# EAGLE schematic ESP32 UWB v1.0 (EAGLE 6.6.0)
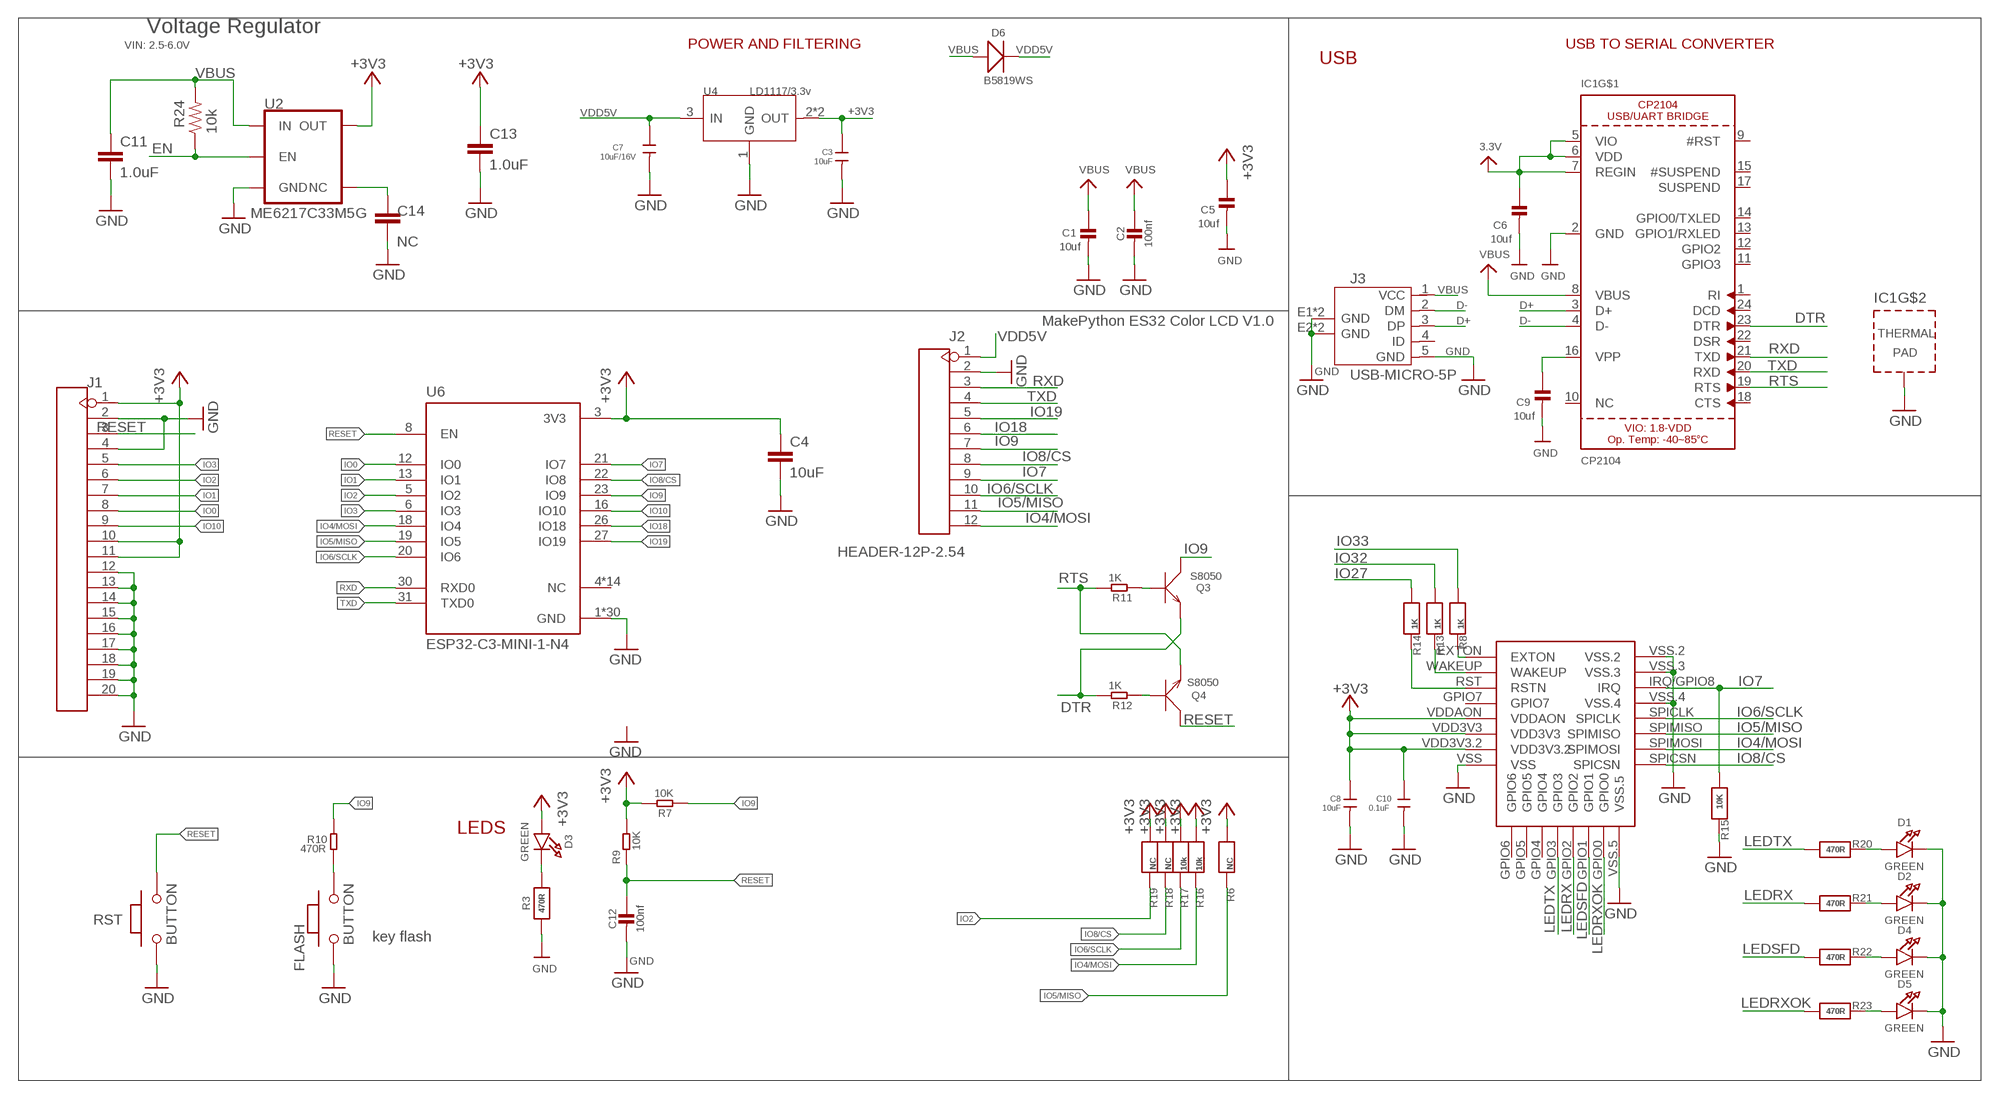
[diagram p0: schematic, sheet 1]

## Parts
C1  10uf  CAP_CERAMIC0603_NO  [0603-NO]
C2  100nf  CAP_CERAMIC0603_NO  [0603-NO]
C3  10uF  C-0603  [C0603]
C4  10uF  C-EUC0603  [C0603]
C5  10uf  CAP_CERAMIC0603_NO  [0603-NO]
C6  10uf  CAP_CERAMIC0603_NO  [0603-NO]
C7  10uF/16V  C-0603  [C0603]
C8  10uF  C-0603  [C0603]
C9  10uf  CAP_CERAMIC0603_NO  [0603-NO]
C10  0.1uF  C-0603  [C0603]
C11  1.0uF  1.0UF-0603-16V-10%  [0603]
C12  100nf  CAP_CERAMIC0603_NO  [0603-NO]
C13  1.0uF  1.0UF-0603-16V-10%  [0603]
C14  NC  1.0UF-0603-16V-10%  [0603]
D1  GREEN  LED0805_NOOUTLINE  [CHIPLED_0805_NOOUTLINE]
D2  GREEN  LED0805_NOOUTLINE  [CHIPLED_0805_NOOUTLINE]
D3  GREEN  LED0805_NOOUTLINE  [CHIPLED_0805_NOOUTLINE]
D4  GREEN  LED0805_NOOUTLINE  [CHIPLED_0805_NOOUTLINE]
D5  GREEN  LED0805_NOOUTLINE  [CHIPLED_0805_NOOUTLINE]
D6  B5819WS  D'0805'  [SOD323]
FLASH  BUTTON  PB157  [157SW]
IC1  CP2104  [QFN24_4MM_SMSC]
J1  HEADER-20P-2.54  [20P-2.54]
J2  HEADER-12P-2.54  [12P-2.54]
J3  USB-MICRO-5P  [MICRO-USB-5P]
Q3  S8050  TRANSISTOR-NPN-SOT23  [SOT23]
Q4  S8050  TRANSISTOR-NPN-SOT23  [SOT23]
R3  470R  RESISTOR_0603_NOOUT  [0603-NO]
R6  NC  RESISTOR_0603_NOOUT  [0603-NO]
R7  10K  R-0603  [0603]
R8  1K  RESISTOR_0603_NOOUT  [0603-NO]
R9  10K  R-0603  [0603]
R10  470R  R-0603  [0603]
R11  1K  R-0603  [0603]
R12  1K  R-0603  [0603]
R13  1K  RESISTOR_0603_NOOUT  [0603-NO]
R14  1K  RESISTOR_0603_NOOUT  [0603-NO]
R15  10K  RESISTOR_0603_NOOUT  [0603-NO]
R16  10k  RESISTOR_0603_NOOUT  [0603-NO]
R17  10k  RESISTOR_0603_NOOUT  [0603-NO]
R18  NC  RESISTOR_0603_NOOUT  [0603-NO]
R19  NC  RESISTOR_0603_NOOUT  [0603-NO]
R20  470R  RESISTOR_0603_NOOUT  [0603-NO]
R21  470R  RESISTOR_0603_NOOUT  [0603-NO]
R22  470R  RESISTOR_0603_NOOUT  [0603-NO]
R23  470R  RESISTOR_0603_NOOUT  [0603-NO]
R24  10k  10KOHM-0603-1/10W-1%  [0603]
RST  BUTTON  PB157  [157SW]
U2  ME6217C33M5G  V_REG_AP2112K-3.3V  [SOT23-5]
U4  LD1117/3.3v  LD1117'SOT89'  [SOT89]
U5  DWM1000  [DWM1000]
U6  ESP32-C3-MINI-1-N4  [XCVR_ESP32-C3-MINI-1-N4]

## Nets
+3V3: C3.1 C4.1 C5.1 C6.1 C8.1 C10.1 C13.1 D3.A IC1.5(VIO) IC1.6(VDD) IC1.7(REGIN) J1.1 J1.10 J1.11 R6.1 R7.2 R9.2 R16.1 R17.1 R18.1 R19.1 U2.5(OUT) U4.2(OUT) U4.4(OUT) U5.VDD3V3 U5.VDD3V3.2 U5.VDDAON U6.3(3V3) ; supply symbol labelled 3.3V
D+: IC1.3(D+) J3.3(DP)
D-: IC1.4(D-) J3.2(DM)
DTR: IC1.23(DTR) Q3.2(E) R12.2
EN: R24.1 U2.3(EN)
GND: C1.2 C2.2 C3.2 C4.2 C5.2 C6.2 C7.2 C8.2 C9.2 C10.2 C11.2 C12.2 C13.2 C14.2 D1.C D2.C D4.C D5.C FLASH.1 IC1.2(GND) IC1.THERM(TP) J1.2 J1.4 J1.12 J1.13 J1.14 J1.15 J1.16 J1.17 J1.18 J1.19 J1.20 J2.2 J3.5(GND) J3.E1(GND) J3.E2(GND) J3.P1(GND) J3.P2(GND) R3.1 R15.2 RST.1 U2.2(GND) U4.1(GND) U5.VSS U5.VSS.2 U5.VSS.3 U5.VSS.4 U5.VSS.5 U6.1(GND) U6.2(GND) U6.11(GND) U6.14(GND) U6.36(GND) U6.37(GND) U6.38(GND) U6.39(GND) U6.40(GND) U6.41(GND) U6.42(GND) U6.43(GND) U6.44(GND) U6.45(GND) U6.46(GND) U6.47(GND) U6.48(GND) U6.49_1(GND) U6.49_2(GND) U6.49_3(GND) U6.49_4(GND) U6.49_5(GND) U6.49_6(GND) U6.49_7(GND) U6.49_8(GND) U6.49_9(GND) U6.50(GND) U6.51(GND) U6.52(GND) U6.53(GND)
IO0: J1.8 U6.12(IO0)
IO1: J1.7 U6.13(IO1)
IO2: J1.6 R19.2 U6.5(IO2)
IO3: J1.5 U6.6(IO3)
IO4/MOSI: J2.12 R16.2 U5.SPIMOSI U6.18(IO4)
IO5/MISO: J2.11 R6.2 U5.SPIMISO U6.19(IO5)
IO6/SCLK: J2.10 R17.2 U5.SPICLK U6.20(IO6)
IO7: J2.9 R15.1 U5.IRQ/GPIO8(IRQ) U6.21(IO7)
IO8/CS: J2.8 R18.2 U5.SPICSN U6.22(IO8)
IO9: J2.7 Q3.3(C) R7.1 R10.2 U6.23(IO9)
IO10: J1.9 U6.16(IO10)
IO18: J2.6 U6.26(IO18)
IO19: J2.5 U6.27(IO19)
IO27: R14.1
IO32: R13.1
IO33: R8.1
LEDRX: R21.1 U5.GPIO2
LEDRXOK: R23.1 U5.GPIO0
LEDSFD: R22.1 U5.GPIO1
LEDTX: R20.1 U5.GPIO3
N$1: D1.A R20.2
N$2: C9.1 IC1.16(VPP)
N$3: C14.1 U2.4(NC)
N$5: D3.C R3.2
N$10: R8.2 U5.EXTON
N$11: R13.2 U5.WAKEUP
N$12: R14.2 U5.RST(RSTN)
N$13: Q4.1(B) R12.1
N$14: Q3.1(B) R11.1
N$15: FLASH.2 R10.1
N$16: D2.A R21.2
N$17: D4.A R22.2
N$18: D5.A R23.2
RESET: C12.1 J1.3 Q4.3(C) R9.1 RST.2 U6.8(EN)
RTS: IC1.19(RTS) Q4.2(E) R11.2
RXD: IC1.21(TXD) J2.3 U6.30(RXD0)
TXD: IC1.20(RXD) J2.4 U6.31(TXD0)
VBUS: C1.1 C2.1 C11.1 D6.+ IC1.8(VBUS) J3.1(VCC) R24.2 U2.1(IN)
VDD5V: C7.1 D6.- J2.1 U4.3(IN)
Unconnected: IC1.1(RI) IC1.9(#RST) IC1.10(NC) IC1.11(GPIO3) IC1.12(GPIO2) IC1.13(GPIO1/RXLED) IC1.14(GPIO0/TXLED) IC1.15(#SUSPEND) IC1.17(SUSPEND) IC1.18(CTS) IC1.22(DSR) IC1.24(DCD) J3.4(ID) U5.GPIO4 U5.GPIO5 U5.GPIO6 U5.GPIO7 U6.4(NC) U6.7(NC) U6.9(NC) U6.10(NC) U6.15(NC) U6.17(NC) U6.24(NC) U6.25(NC) U6.28(NC) U6.29(NC) U6.32(NC) U6.33(NC) U6.34(NC) U6.35(NC)

## Notes on the sheet
- Voltage Regulator
- VIN: 2.5-6.0V | POWER AND FILTERING | USB TO SERIAL CONVERTER
- USB
- MakePython ES32 Color LCD V1.0
- LEDS
- key flash

## Library data of the parts
C1 C2 C5 C6 C9 C12 = microbuilder:CAP_CERAMIC: Ceramic Capacitors For new designs, use the packages preceded by an '_' character since they are more reliable: The following footprints should be used on most boards: _0402 - Standard footprint for regular board layouts _0603 - Standard footprint for regular board layouts _0805 - Standard footprint for regular board layouts _1206 - Standard footprint for regular board layouts For extremely tight-pitch boards where space is at a premium, the following 'micro-pitch' footprints can be used (smaller pads, no silkscreen outline, etc.): _0402MP - Micro-pitch footprint for very dense/compact boards _0603MP - Micro-pitch footprint for very dense/compact boards _0805MP - Micro-pitch footprint for very dense/compact boards _1206MP - Micro-pitch footprint for very dense/compact boards
C3 C7 C8 C10 = Discrete:C*: Ceramic Capacitors
C4 = rcl:C-EU: CAPACITOR, European symbol
C11 C13 = SparkFun-Capacitors:1.0UF: 1µF ceramic capacitors A capacitor is a passive two-terminal electrical component used to store electrical energy temporarily in an electric field.; PROD_ID: CAP-00868
C14 = SparkFun-Capacitors:1.0UF: 1µF ceramic capacitors A capacitor is a passive two-terminal electrical component used to store electrical energy temporarily in an electric field.; PROD_ID: CAP-00868; VALUE: 1.0uF
D1-D5 = microbuilder:LED: LED 0603 - 0603 Surface Mount Package 2mA: Green LED - Low Power (3.9mcd, 2ma, 1.7Vf) - Digikey: 475-2709-2-ND Orange LED - Low Power (9.8mcd, 2ma, 1.8Vf) - Digikey: 475-1194-2-ND Red LED - Low Power (5mcd, 2ma, 1.8Vf) - Digikey: 475-1195-2-ND Yellow LED - Low Power (7mcd, 2ma, 1.8Vf) - Digikey: 475-1196-2-ND 5mA: Blue LED - Low Power (17mcd, 5ma, 2.9Vf) - Digikey: LNJ937W8CRACT-ND 0805 - 0805 Surface Mount Package 2mA: Red LED (8.8mcd, 2mA, 1.8Vf, Clear) - Low Power [Digikey: 475-2510-1-ND] Green LED (5mcd, 2mA, 1.8Vf, Clear) - Low Power [Digikey: 475-2730-1-ND] Yellow LED (11.3mcd, 2mA, 1.8Vf, Clear) - Low Power [Digikey: 475-2555-1-ND] 20mA: Red LED (104mcd, 20mA, Diffused) - LS R976 [Digikey: 475-1278-6-ND] Red LED (12mcd, 20mA, 2.0Vf, Clear) - APT2012EC [Digikey: 754-1128-1-ND] Green LED (15mcd, 20mA, 2.2Vf, Clear) - APT2012GC [Digikey: 754-1131-1-ND] Orange LED (160mcd, 20mA, 2.1Vf, Clear) - APT2012SECK [Digikey: 754-1130-1-ND] 1206 - 1206 Surface Mount Package Green LED (26mcd, 20mA, Diffused) - LG N971 [Digikey: 475-1407-6-ND] Red LED (15mcd, 20mA, Diffused) - LH N974 [Digikey: 475-1416-6-ND] Cree - Cree High-Power Surface Mount LEDs XPEBWT-L1-0000-00D50 - White 111lm 350mA 2.9Vf 6200K 110° XTEAWT-00-0000-00000LEE3 - White 114lm 350mA 2.85Vf 5000K 115° Everlight - Everlight 45-21 Series Surface Mount LEDs 45-21/QK2C-B2832AC2CB2/2T - Warm White 2000mcd 20mA 3.25Vf 3050K 120° 45-21/LK2C-B38452C4CB2/2T - Nuetral White 2000mcd 20mA 3.25Vf 4150K 120° 45-21/LK2C-B50634C6CB2/2T - Cold White 2200mcd 20mA 3.25Vf 5650K 120° PLCC2 Reverse Mount LS T77K-J1L2-1-0-2-R18-Z - Red 11.25mcd 2mA 1.8Vf 630nm 120° LO T77K-L1M2-24-Z - Orange 19.6mcd 2mA 1.8Vf 606nm 120° LY T77K-K2M1-26-Z - Yellow 15.7mcd 2mA 1.8Vf 587nm 120°
D6 = Discrete:D*
FLASH RST = MySMD:PB157
IC1 = microbuilder:CP2104: CP2104 - USB to UART Bridge VDD Output: 3.45V
J1 = Connector:HEADER-20P
J2 = Connector:HEADER-12P
J3 = Connector:USB-MICRO-5P
Q3 Q4 = Discrete:TRANSISTOR-NPN*: NPN audion
R3 R6 R8 R13-R23 = microbuilder:RESISTOR: Resistors For new designs, use the packages preceded by an '_' character since they are more reliable: The following footprints should be used on most boards: _0402 - Standard footprint for regular board layouts _0603 - Standard footprint for regular board layouts _0805 - Standard footprint for regular board layouts _1206 - Standard footprint for regular board layouts For extremely tight-pitch boards where space is at a premium, the following 'micro-pitch' footprints can be used (smaller pads, no silkscreen outline, etc.): _0402MP - Micro-pitch footprint for very dense/compact boards _0603MP - Micro-pitch footprint for very dense/compact boards _0805MP - Micro-pitch footprint for very dense/compact boards _1206MP - Micro-pitch footprint for very dense/compact boards
R7 R9-R12 = Discrete:R*
R24 = SparkFun-Resistors:10KOHM: 10kΩ resistor A resistor is a passive two-terminal electrical component that implements electrical resistance as a circuit element. Resistors act to reduce current flow, and, at the same time, act to lower voltage levels within circuits. - Wikipedia; PROD_ID: RES-00824
U2 = SparkFun-IC-Power:V_REG_AP2112: AP2112 - 600mA CMOS LDO Regulator w/ Enable The AP2112 is CMOS process low dropout linear regulator with enable function, the regulator delivers a guaranteed 600mA (min.) continuous load current. Features Output Voltage Accuracy: ±1.5% Output Current: 600mA (Min.) Foldback Short Current Protection: 50mA Enable Function to Turn ON/OFF VOUT Low Dropout Voltage (3.3V): 250mV (Typ.) @IOUT=600mA Excellent Load Regulation: 0.2%/A (Typ.) Excellent Line Regulation: 0.02%/V (Typ.) Low Quiescent Current: 55μA (Typ.) Low Standby Current: 0.01μA (Typ.) Low Output Noise: 50μVRMS PSRR: 100Hz -65dB, 1kHz -65dB OTSD Protection Stable with 1.0μF Flexible Cap: Ceramic, Tantalum and Aluminum Electrolytic Operation Temperature Range: -40°C to 85°C ESD: MM 400V, HBM 4000V; PROD_ID: VREG-12457; VALUE: 3.3V
U4 = IC:LD1117: Low Drop Fixed And Adjustable Positive Voltage Regulators http://www.datasheetcatalog.org/datasheet/SGSThomsonMicroelectronics/mXuqtqv.pdf
U5 = DWM1000:DWM1000
U6 = ESP32-C3-MINI-1-N4:ESP32-C3-MINI-1-N4: Check prices <https://pricing.snapeda.com/parts/ESP32-C3-MINI-1-N4/Espressif%20Systems/view-part?ref=eda>; AVAILABILITY: In Stock; DESCRIPTION: Bluetooth, WiFi 802.11b/g/n, Bluetooth v5.0 Transceiver Module 2.412GHz ~ 2.484GHz PCB Trace Surface Mount; MF: Espressif Systems; MP: ESP32-C3-MINI-1-N4; PACKAGE: SMD-53 Espressif Systems; PRICE: None; PURCHASE-URL: https://pricing.snapeda.com/search/part/ESP32-C3-MINI-1-N4/?ref=eda

## Net classes
0 default: width 0.203 mm, drill 0.3 mm, clearance 0.152 mm